# EAGLE design Geiger_Counter-v0.9b (EAGLE 5.10)
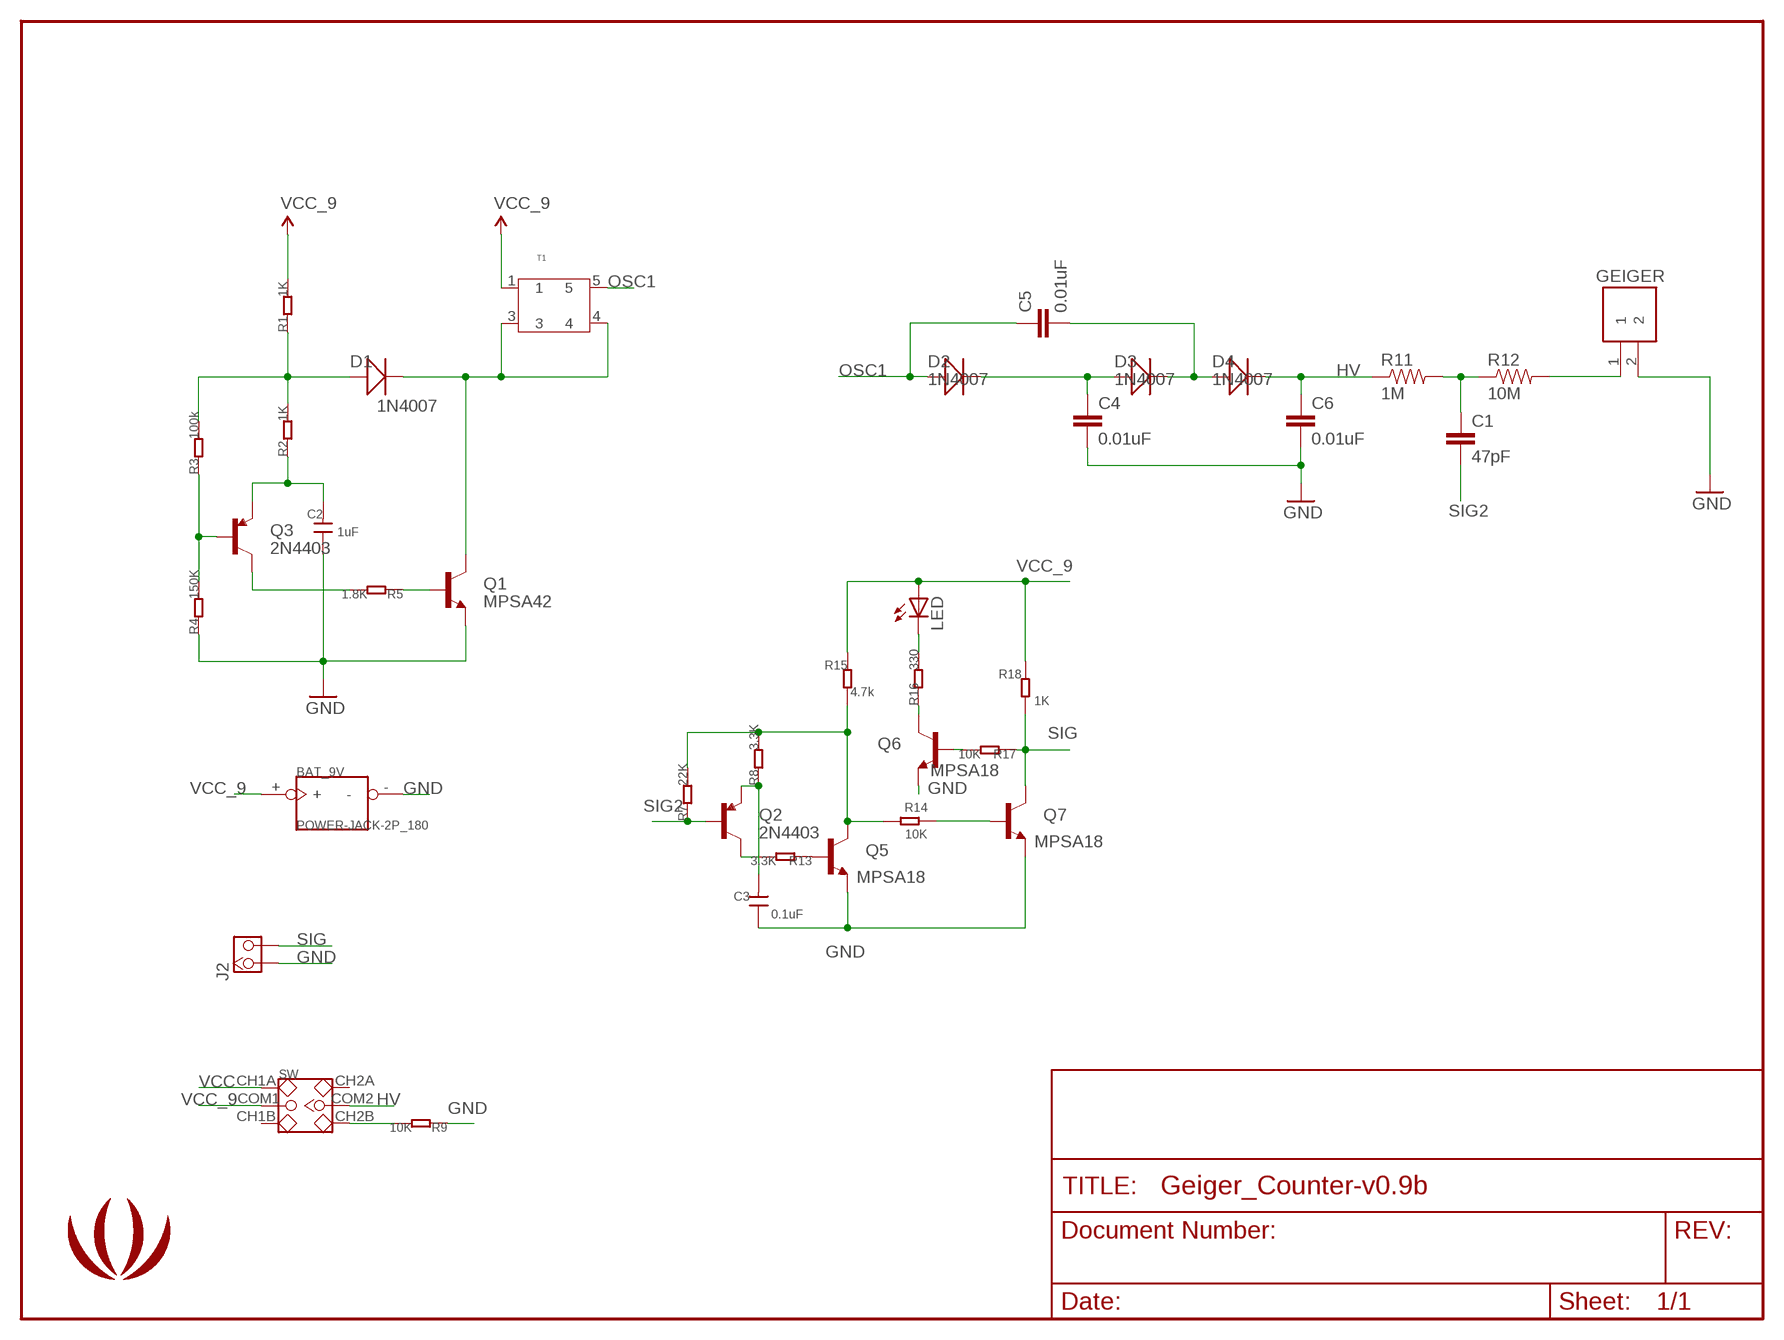
[diagram p0: schematic, sheet 1]

## Parts
BAT_9V  POWER-JACK-2P_180  [POWER-JACK-2P]
C1  47pF  CAP_  [AXIAL-5MM]
C2  1uF  006-C45*60  [0805]
C3  0.1uF  006-C35*35  [0603-1]
C4  0.01uF  CAPPTH3  [CAP-PTH-LARGE]
C5  0.01uF  CAPPTH3  [CAP-PTH-LARGE]
C6  0.01uF  CAPPTH3  [CAP-PTH-LARGE]
D1  1N4007  004-D1206  [D1206]
D2  1N4007  004-D1206  [D1206]
D3  1N4007  004-D1206  [D1206]
D4  1N4007  004-D1206  [D1206]
GEIGER  CON2  [CON2]
J2  HEADER_1X2_2.54_2.54  [65*35]
LED  007-LED3MM  [LED3MM]
LOGO1  LOGO_SILK  [LOGO_SILK]
Q1  MPSA42  TRANSISTOR_NPNSOT23-3  [SOT23-3]
Q2  2N4403  TRANSISTOR_PNPSMD  [SOT23-3]
Q3  2N4403  TRANSISTOR_PNPSMD  [SOT23-3]
Q5  MPSA18  TRANSISTOR_NPNTO92  [TO-92]
Q6  MPSA18  TRANSISTOR_NPNTO92  [TO-92]
Q7  MPSA18  TRANSISTOR_NPNTO92  [TO-92]
R1  1K  005-R0603  [0603-1]
R2  1K  005-R0603  [0603-1]
R3  100k  005-R0603  [0603-1]
R4  150K  005-R0603  [0603-1]
R5  1.8K  005-R0603  [0603-1]
R7  22K  005-R0603  [0603-1]
R8  3.3K  005-R0603  [0603-1]
R9  10K  005-R0603  [0603-1]
R11  1M  005-RESISTORPTH1  [AXIAL-0.3]
R12  10M  005-RESISTORPTH1  [AXIAL-0.3]
R13  3.3K  005-R0603  [0603-1]
R14  10K  005-R0603  [0603-1]
R15  4.7k  005-R0603  [0603-1]
R16  330  005-R0603  [0603-1]
R17  10K  005-R0603  [0603-1]
R18  1K  005-R0603  [0603-1]
SW  2.54SW_2CH_TH  [2.54SW_2CH]
T1  EI14-TRANSFORMER  [EI14-TRANSFORMER]

## Nets
GND: BAT_9V.- C2.1 C3.1 C4.2 C6.2 GEIGER.2 J2.1 Q1.2(E) Q5.1(E) Q6.1(E) Q7.1(E) R4.1 R9.1
HV: C6.1 D4.- R11.P$1 SW.COM2
N$2: D1.+ R1.1 R2.2 R3.2
N$3: GEIGER.1 R12.P$2
N$4: C2.2 Q3.2(E) R2.1
N$5: C3.2 Q2.2(E) R8.1
N$6: Q3.3(C) R5.2
N$8: Q5.3(C) R7.2 R8.2 R14.2 R15.1
N$9: Q1.1(B) R5.1
N$10: D1.- Q1.3(C) T1.3 T1.4
N$11: C4.1 D2.- D3.+
N$12: C5.2 D3.- D4.+
N$13: C1.P$1 R11.P$2 R12.P$1
N$15: Q2.3(C) R13.2
N$16: R9.2 SW.CH2B
N$17: Q5.2(B) R13.1
N$18: Q6.2(B) R17.2
N$19: Q6.3(C) R16.1
N$20: Q7.2(B) R14.1
N$22: LED.K(C) R16.2
OSC1: C5.1 D2.+ T1.5
OSC2: Q3.1(B) R3.1 R4.2
SIG: J2.2 Q7.3(C) R17.1 R18.2
SIG2: C1.P$2 Q2.1(B) R7.1
VCC: R1.2 SW.CH1A T1.1 ; supply symbol labelled VCC_9
VCC_9: BAT_9V.+ LED.A R15.2 R18.1 SW.COM1
Unconnected: SW.CH1B SW.CH2A

## Library data of the parts
BAT_9V = Connector:POWER-JACK-2P
C1 C4-C6 = SparkFun:CAP: Capacitor Standard 0603 ceramic capacitor, and 0.1" leaded capacitor.
C2 C3 = Discrete:006-C*: Ceramic Capacitors
D1-D4 = Discrete:004-D*
GEIGER = seeedleo:CON2
J2 = Connector:HEADER_1X2_2.54
LED = Discrete:007-LED: LEDs Standard schematic elements and footprints for 5mm, 3mm, 1206, and 0603 sized LEDs. 5mm - Spark Fun Electronics SKU : COM-00529 (and others)
LOGO1 = logo:LOGO_SILK
Q1 Q5-Q7 = SparkFun:TRANSISTOR_NPN: Transistor NPN BJT configuration in SOT23 package. MMBT2222 is the common NPN we use. Double check BCE configuration again layout.
Q2 Q3 = SparkFun:TRANSISTOR_PNP
R1-R5 R7-R9 R13-R18 = Discrete:005-R*
R11 R12 = Discrete:005-RESISTOR: Resistor Basic schematic elements and footprints for 0603, 1206, and PTH 1/10th watt (small) resistors.
SW = CPT_CJ:2.54SW_2CH
T1 = Discrete:EI14-TRANSFORMER

## Board
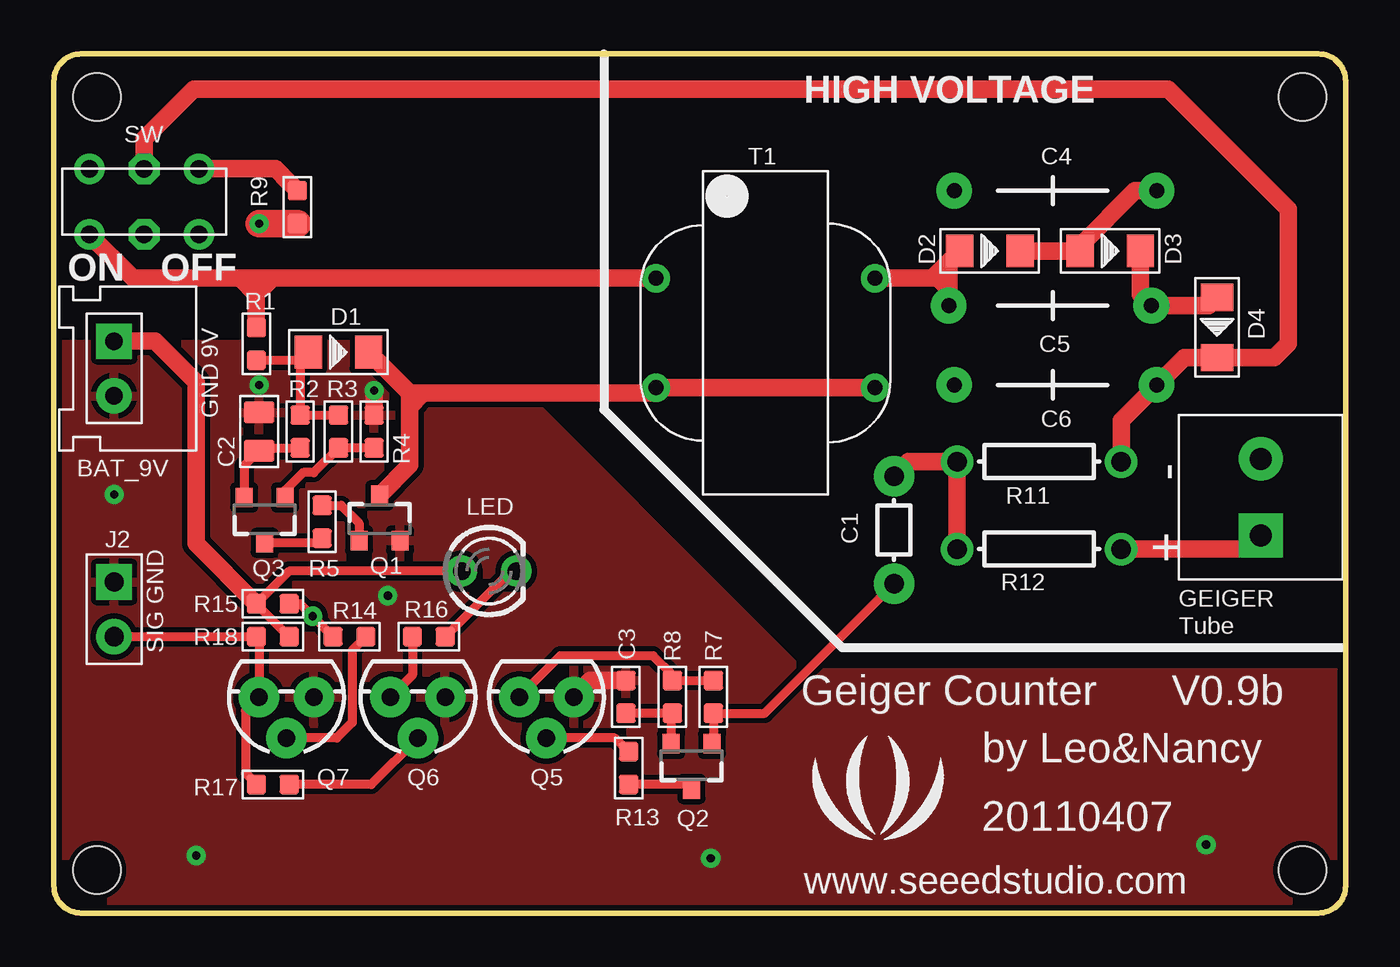
[diagram p1: board, top side]
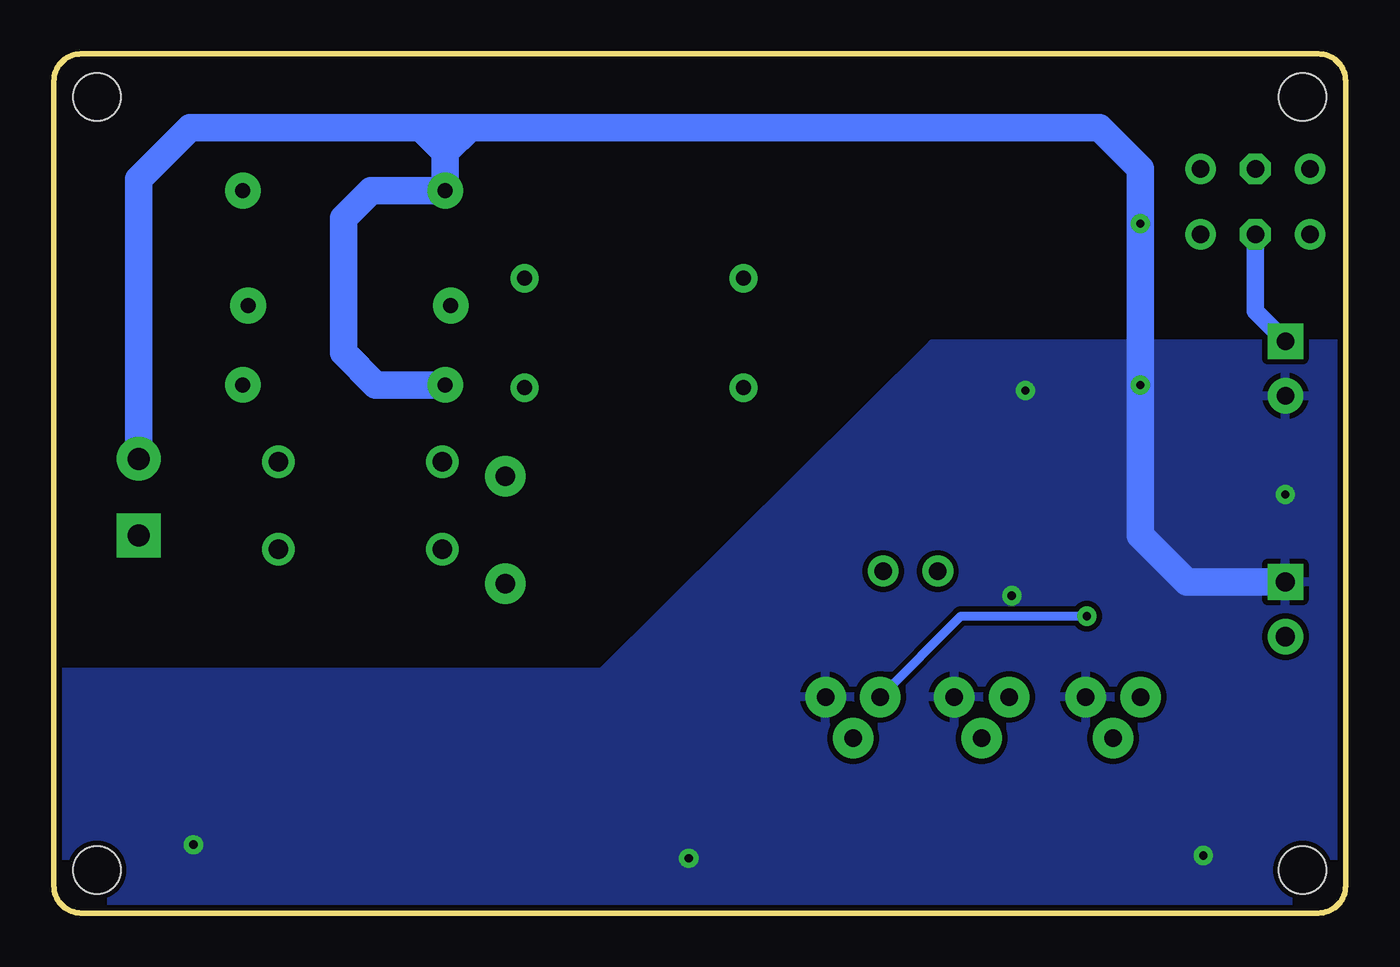
[diagram p2: board, bottom side, seen from below]

Size 59.94 x 39.88 mm. Coordinates in mm from the lower left corner, seen from the top.
Outline: 58.67,0 arc90 59.94,1.27 59.94,38.61 arc90 58.67,39.88 1.27,39.88 arc90 0,38.61 0,1.27 arc90 1.27,0 58.67,0
Copper layers (1*16): Top 0.035mm / dielectric 1.5mm / Bottom 0.035mm
Design rules "SparkFun *": minimum track width 8mil, minimum drill 15mil, track to track 8mil, track to pad 8mil, pad to pad 8mil, via to via 8mil, smd to smd 8mil, copper to edge 8mil, drill to drill 8mil, minimum pad ring 12mil, minimum via ring 10mil, stop-mask expansion 4mil, vias tented up to drill 20mil, thermal gap 10mil
Holes 2.2 mm at 2,37.88 57.94,37.88 2,2 57.94,2

### Footprints (pad centres in the part's own frame; a part is rotated, then mirrored left to right if it is on the bottom)
POWER-JACK-2P = drill 0.813 pad 1.651 square: + 1.27,0 | drill 0.813 pad 1.651 round: - -1.27,0
AXIAL-5MM = drill 0.9 pad 1.88 round: P$1 -2.5,0; P$2 2.5,0
0805 = smd 1.016 x 1.397: 1 -0.889,0; 2 0.889,0
0603-1 = smd 0.889 x 0.889: 1 -0.762,0; 2 0.762,0
CAP-PTH-LARGE = drill 0.7 pad 1.651 round: 1 -4.826,0; 2 4.572,0
D1206 = smd 1.27 x 1.524: + -1.397,0; - 1.397,0
CON2 = drill 1.016 pad 2.032 square: 1 0,1.778 | drill 1.016 pad 2.032 round: 2 0,-1.778
65*35 = drill 0.889 pad 1.651 square: 1 0,1.27 | drill 0.889 pad 1.651 round: 2 0,-1.27
LED3MM = drill 0.813 round: A -1.27,0; K 1.27,0
SOT23-3 = smd 0.8 x 0.9: 1 -0.95,-1; 2 0.95,-1; 3 0,1.1
TO-92 = drill 0.813 pad 1.88 round: 1 -1.27,0; 2 0,1.905; 3 1.27,0
AXIAL-0.3 = drill 0.9 round: P$1 -3.81,0; P$2 3.81,0
2.54SW_2CH = drill 0.813 pad 1.27 round: CH1A -1.524,2.54; CH1B -1.524,-2.54; CH2A 1.524,2.54; CH2B 1.524,-2.54 | drill 0.813 pad 1.27 octagon: COM1 -1.524,0; COM2 1.524,0
EI14-TRANSFORMER = drill 0.7 pad 1.15 round: 1 2.54,5.08; 3 -2.54,5.08; 4 -2.54,-5.08; 5 2.54,-5.08

### Placement (x,y rotation side)
BAT_9V  2.79,25.27 90 top
C1  38.99,17.78 270 top
C2  9.52,22.35 270 top
C3  26.54,10.03 270 top
C4  46.36,33.53 180 top
C5  46.36,28.19 0 top
C6  46.36,24.51 180 top
D1  13.21,26.04 0 top
D2  43.43,30.73 0 top
D3  49.02,30.73 0 top
D4  53.98,27.18 270 top
GEIGER  56.01,19.3 180 top
J2  2.79,14.1 0 top
LED  20.19,15.88 0 top
LOGO1  38.23,5.08 0 top
Q1  15.11,18.29 0 top
Q2  29.59,6.86 180 top
Q3  9.78,18.29 180 top
Q5  22.86,10.03 180 top
Q6  16.89,10.03 180 top
Q7  10.79,10.03 180 top
R1  9.4,26.42 90 top
R2  11.43,22.35 90 top
R3  13.21,22.35 90 top
R4  14.86,22.35 270 top
R5  12.45,18.16 270 top
R7  30.61,10.03 90 top
R8  28.7,10.03 90 top
R9  11.3,32.77 90 top
R11  45.72,20.95 180 top
R12  45.72,16.89 0 top
R13  26.67,6.73 270 top
R14  13.72,12.83 180 top
R15  10.16,14.35 180 top
R16  17.4,12.83 0 top
R17  10.16,5.97 0 top
R18  10.16,12.83 180 top
SW  4.19,33.02 90 top
T1  33.02,26.92 90 top

### Tracks (layer width: path | path; a pad name or v marks a point on that pad's centre or on a via)
GND  (via drill 0.38 pad 0.81)
  Top 0.813: C3.1 24.89,10.8 Q5.1 | R4.1 v14.86,24.26
  Top 1.27: R9.1 v9.52,32
  Bottom 1.27: 41.78,36.45 53.61,36.45 56.01,34.06 GEIGER.2 | C6.2 45,24.51 46.5,26 46.5,32.26 45.23,33.53 C4.2 41.78,35.31 | 41.78,36.45 41.78,35.43 | 41.78,35.43 41.78,35.31 | 41.78,35.31 40.64,36.45 | 41.78,35.43 41.91,35.43 42.93,36.45 | 41.78,36.45 11.44,36.45 9.52,34.54 v9.52,32 v9.52,24.51 9.52,17.53 7.37,15.37 J2.1
  other vias: 15.49,14.73 2.79,19.43 6.6,2.67 30.48,2.54 53.47,3.18
  pour Top (isolate 0.254): 19.18,26.42 19.3,26.56 34.69,11.18 59.82,11.18 59.82,-2.29 -1.78,-2.29 -1.78,26.42
  pour Bottom (isolate 0.254): 19.18,26.42 19.18,26.41 34.53,11.18 59.82,11.18 59.82,-2.29 -1.78,-2.29 -1.78,26.42
HV
  Top 0.813: SW.COM2 4.19,35.94 6.5,38.25 51.72,38.25 57.29,32.68 57.29,26.42 56.64,25.78 D4.- 52.45,25.78 C6.1 49.53,22.86 R11.P$1
N$2
  Top 0.406: R3.2 R2.2 11.43,25.65 | 11.43,25.65 R1.1 | D1.+ 11.43,25.65
N$3
  Top 0.813: R12.P$2 55.37,16.89 GEIGER.1
N$4
  Top 0.406: Q3.2 8.83,20.77 C2.2 9.65,21.59 R2.1
N$5
  Top 0.406: C3.2 R8.1 28.64,9.21 Q2.2
N$6
  Top 0.406: Q3.3 12.23,17.19 R5.2
N$8  (via drill 0.38 pad 0.81)
  Top 0.406: R7.2 R8.2 28.7,11.05 27.81,11.94 23.49,11.94 Q5.3 | R15.1 11.43,14.35 v12,13.78 R14.2
  Bottom 0.406: Q5.3 17.84,13.78 v12,13.78
N$9
  Top 0.406: Q1.1 14.16,18.09 13.33,18.92 R5.1
N$10
  Top 0.813: D1.- 16.51,24.13 | 16.51,24.13 16.51,23.5 | 16.51,23.5 16.51,20.79 Q1.3 | 16.51,24.13 17.14,24.13 | 17.14,24.13 27.69,24.13 T1.3 T1.4 | 16.51,23.5 17.14,24.13
N$11
  Top 0.813: D2.- D3.+ 47.62,30.99 50.16,33.53 C4.1
N$12
  Top 0.813: D3.- 50.42,28.7 C5.2 53.59,28.19 D4.+
N$13
  Top 0.813: R12.P$1 R11.P$2 39.66,20.95 C1.P$1
N$15
  Top 0.406: R13.2 29.38,5.97 Q2.3
N$16
  Top 0.813: R9.2 10.67,34.16 10.54,34.29 10.29,34.54 SW.CH2B
N$17
  Top 0.406: Q5.2 26.03,8.13 R13.1
N$18
  Top 0.406: R17.2 14.73,5.97 Q6.2
N$19
  Top 0.406: R16.1 16.64,11.05 Q6.3
N$20
  Top 0.406: Q7.2 13.12,8.13 13.84,8.85 13.84,12.19 R14.1
N$22
  Top 0.406: 18.41,13.08 R16.2 21.21,15.88 LED.K
OSC1
  Top 0.813: 41.53,30.23 41.53,29.46 | 41.53,29.46 41.53,28.96 | 41.53,28.96 C5.1 | 41.53,30.23 D2.+ | 41.02,29.46 41.53,29.46 | T1.5 40.89,29.46 | 40.89,29.46 41.02,29.46 | 41.02,29.46 41.53,28.96 | 40.89,29.46 40.89,29.59 41.53,30.23
OSC2
  Top 0.406: Q3.1 10.73,19.62 11.56,20.45 12.06,20.45 R3.1 R4.2
SIG
  Top 0.406: J2.2 R18.2 9.52,12.7 Q7.3 8.89,9.4 8.89,6.48 R17.1
SIG2
  Top 0.406: Q2.1 30.61,7.92 R7.1 32.98,9.27 C1.P$2
VCC
  Top 0.813: 9.27,29.46 8.64,29.46 | 8.64,29.46 3.68,29.46 SW.CH1A | 10.16,29.46 9.27,29.46 | 10.16,29.46 T1.1 | 9.4,28.7 9.4,29.34 9.27,29.46 | 9.4,28.7 R1.2 | 9.4,28.7 8.64,29.46 | 10.16,29.46 9.4,28.7
VCC_9
  Top 0.406: R18.1 R15.2 10.92,15.88 LED.A
  Top 0.813: BAT_9V.+ 4.7,26.54 6.6,24.64 6.6,17.14 R15.2
  Bottom 0.813: SW.COM1 4.19,27.94 BAT_9V.+

### Text on the board
tPlace: HIGH VOLTAGE | ON | OFF | 9V | GND | - | + | GND | Tube | SIG | Geiger Counter | V0.9b | by Leo&Nancy | 20110407 | www.seeedstudio.com